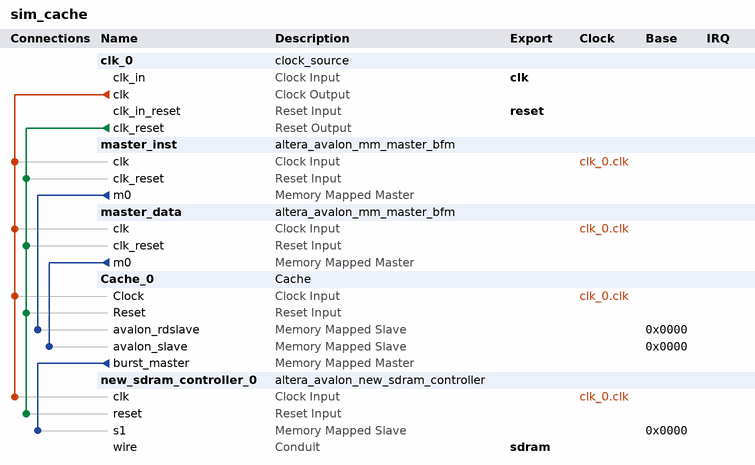
[diagram p0: system contents]
# Platform Designer (Qsys) system sim_cache, Cyclone IV GX EP4CGX150DF31C8
# Parameters at their usual value, and those the tool derives, are not listed.
package require -exact qsys 15.1
create_system sim_cache
set_project_property DEVICE_FAMILY {Cyclone IV GX}
set_project_property DEVICE EP4CGX150DF31C8

add_instance clk_0 clock_source 15.1
set_instance_parameter_value clk_0 clockFrequency 50000000

add_instance master_inst altera_avalon_mm_master_bfm 15.1
set_instance_parameter_value master_inst ADDRESS_UNITS SYMBOLS
set_instance_parameter_value master_inst AV_ADDRESS_W 32
set_instance_parameter_value master_inst AV_ALWAYS_BURST_MAX_BURST 0
set_instance_parameter_value master_inst AV_BURSTCOUNT_W 3
set_instance_parameter_value master_inst AV_BURST_BNDR_ONLY 1
set_instance_parameter_value master_inst AV_BURST_LINEWRAP 1
set_instance_parameter_value master_inst AV_CONSTANT_BURST_BEHAVIOR 1
set_instance_parameter_value master_inst AV_FIX_READ_LATENCY 1
set_instance_parameter_value master_inst AV_MAX_PENDING_WRITES 0
set_instance_parameter_value master_inst AV_NUMSYMBOLS 4
set_instance_parameter_value master_inst AV_READRESPONSE_W 8
set_instance_parameter_value master_inst AV_READ_WAIT_TIME 1
set_instance_parameter_value master_inst AV_WRITERESPONSE_W 8
set_instance_parameter_value master_inst USE_BURSTCOUNT 0
set_instance_parameter_value master_inst USE_BYTE_ENABLE 0
set_instance_parameter_value master_inst USE_READ 1
set_instance_parameter_value master_inst USE_READ_DATA 1
set_instance_parameter_value master_inst USE_READ_DATA_VALID 0
set_instance_parameter_value master_inst USE_WAIT_REQUEST 1
set_instance_parameter_value master_inst USE_WRITE 0
set_instance_parameter_value master_inst USE_WRITE_DATA 0
set_instance_parameter_value master_inst VHDL_ID 0

add_instance master_data altera_avalon_mm_master_bfm 15.1
set_instance_parameter_value master_data ADDRESS_UNITS SYMBOLS
set_instance_parameter_value master_data AV_ADDRESS_W 32
set_instance_parameter_value master_data AV_ALWAYS_BURST_MAX_BURST 0
set_instance_parameter_value master_data AV_BURSTCOUNT_W 3
set_instance_parameter_value master_data AV_BURST_BNDR_ONLY 1
set_instance_parameter_value master_data AV_BURST_LINEWRAP 1
set_instance_parameter_value master_data AV_CONSTANT_BURST_BEHAVIOR 1
set_instance_parameter_value master_data AV_FIX_READ_LATENCY 1
set_instance_parameter_value master_data AV_MAX_PENDING_WRITES 0
set_instance_parameter_value master_data AV_NUMSYMBOLS 4
set_instance_parameter_value master_data AV_READRESPONSE_W 8
set_instance_parameter_value master_data AV_READ_WAIT_TIME 1
set_instance_parameter_value master_data AV_WRITERESPONSE_W 8
set_instance_parameter_value master_data USE_BURSTCOUNT 0
set_instance_parameter_value master_data USE_BYTE_ENABLE 1
set_instance_parameter_value master_data USE_READ 1
set_instance_parameter_value master_data USE_READ_DATA 1
set_instance_parameter_value master_data USE_READ_DATA_VALID 0
set_instance_parameter_value master_data USE_WAIT_REQUEST 1
set_instance_parameter_value master_data VHDL_ID 0

add_instance Cache_0 Cache 1.0
set_instance_parameter_value Cache_0 ADDR_WIDTH 32
set_instance_parameter_value Cache_0 CACHE_LINE_WIDTH 4
set_instance_parameter_value Cache_0 TAG_WIDTH 24

add_instance new_sdram_controller_0 altera_avalon_new_sdram_controller 15.1
set_instance_parameter_value new_sdram_controller_0 TAC 5.5
set_instance_parameter_value new_sdram_controller_0 TRCD 20.0
set_instance_parameter_value new_sdram_controller_0 TRP 20.0
set_instance_parameter_value new_sdram_controller_0 casLatency 3
set_instance_parameter_value new_sdram_controller_0 columnWidth 8
set_instance_parameter_value new_sdram_controller_0 dataWidth 32
set_instance_parameter_value new_sdram_controller_0 generateSimulationModel true
set_instance_parameter_value new_sdram_controller_0 model single_Micron_MT48LC4M32B2_7_chip
set_instance_parameter_value new_sdram_controller_0 numberOfBanks 4
set_instance_parameter_value new_sdram_controller_0 numberOfChipSelects 1
set_instance_parameter_value new_sdram_controller_0 powerUpDelay 1.0
set_instance_parameter_value new_sdram_controller_0 refreshPeriod 15.625
set_instance_parameter_value new_sdram_controller_0 rowWidth 13

# connections
add_connection clk_0.clk Cache_0.Clock clock
add_connection clk_0.clk master_data.clk clock
add_connection clk_0.clk master_inst.clk clock
add_connection clk_0.clk new_sdram_controller_0.clk clock
add_connection clk_0.clk_reset Cache_0.Reset reset
add_connection clk_0.clk_reset master_data.clk_reset reset
add_connection clk_0.clk_reset master_inst.clk_reset reset
add_connection clk_0.clk_reset new_sdram_controller_0.reset reset
add_connection Cache_0.burst_master new_sdram_controller_0.s1 avalon
set_connection_parameter_value Cache_0.burst_master/new_sdram_controller_0.s1 baseAddress 0x0000
add_connection master_data.m0 Cache_0.avalon_slave avalon
set_connection_parameter_value master_data.m0/Cache_0.avalon_slave baseAddress 0x0000
add_connection master_inst.m0 Cache_0.avalon_rdslave avalon
set_connection_parameter_value master_inst.m0/Cache_0.avalon_rdslave baseAddress 0x0000

# exported interfaces
add_interface clk clock sink
set_interface_property clk EXPORT_OF clk_0.clk_in
add_interface reset reset sink
set_interface_property reset EXPORT_OF clk_0.clk_in_reset
add_interface sdram conduit end
set_interface_property sdram EXPORT_OF new_sdram_controller_0.wire

set_interconnect_requirement {$system} qsys_mm.clockCrossingAdapter HANDSHAKE
set_interconnect_requirement {$system} qsys_mm.enableEccProtection FALSE
set_interconnect_requirement {$system} qsys_mm.insertDefaultSlave FALSE
set_interconnect_requirement {$system} qsys_mm.maxAdditionalLatency 1

save_system sim_cache.qsys
